# Altium schematic sheet Z7_BANK500_501.SchDoc
size A3
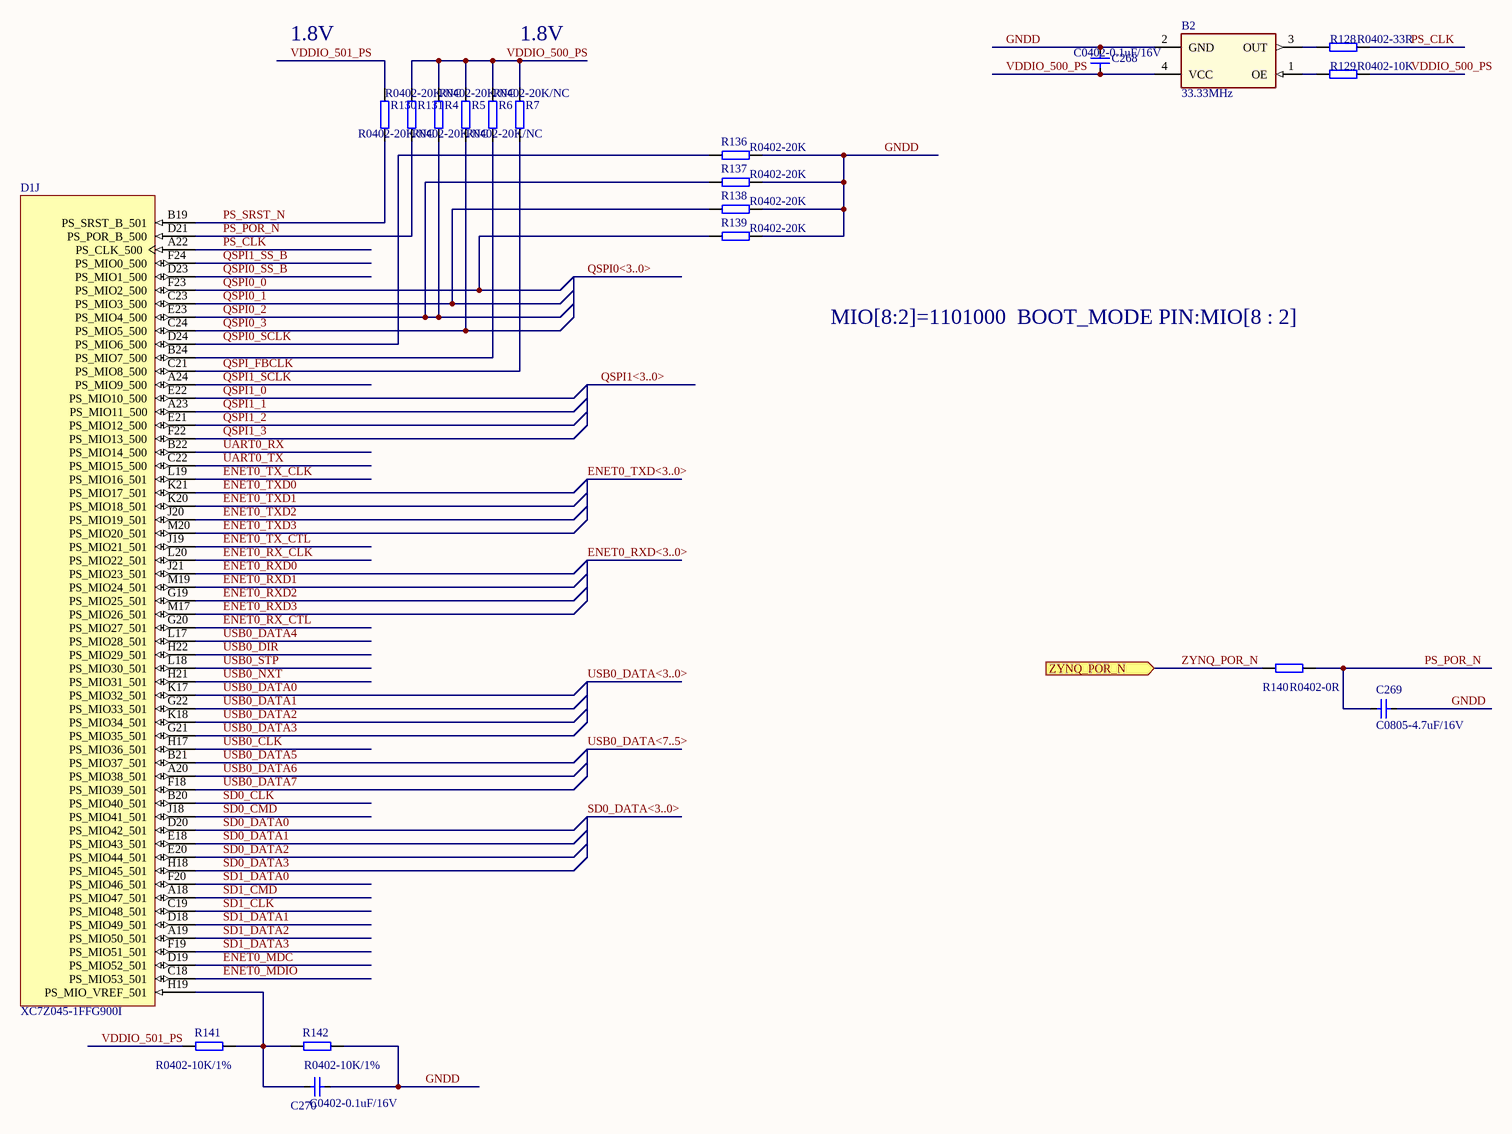
[diagram p0: Z7_BANK500_501.SchDoc]

## Parts
B2  33.33MHz  [OSC3225-4P]
C268  C0402-0.1uF/16V  [C0402]
C269  C0805-4.7uF/16V  [C0805]
C270  C0402-0.1uF/16V  [C0402]
D1  XC7Z045-1FFG900I  [FFG900]  (part J of 16)
R4  R0402-20K/NC  [R0402]
R5  R0402-20K/NC  [R0402]
R6  R0402-20K/NC  [R0402]
R7  R0402-20K/NC  [R0402]
R128  R0402-33R  [R0402]
R129  R0402-10K  [R0402]
R130  R0402-20K/NC  [R0402]
R131  R0402-20K/NC  [R0402]
R136  R0402-20K  [R0402]
R137  R0402-20K  [R0402]
R138  R0402-20K  [R0402]
R139  R0402-20K  [R0402]
R140  R0402-0R  [R0402]
R141  R0402-10K/1%  [R0402]
R142  R0402-10K/1%  [R0402]

## Ports
ZYNQ_POR_N (in)

## Nets
ENET0_MDC: D1.D19(PS_MIO52_501)
ENET0_MDIO: D1.C18(PS_MIO53_501)
ENET0_RX_CLK: D1.L20(PS_MIO22_501)
ENET0_RX_CTL: D1.G20(PS_MIO27_501)
ENET0_RXD0: D1.J21(PS_MIO23_501)
ENET0_RXD1: D1.M19(PS_MIO24_501)
ENET0_RXD2: D1.G19(PS_MIO25_501)
ENET0_RXD3: D1.M17(PS_MIO26_501)
ENET0_TX_CLK: D1.L19(PS_MIO16_501)
ENET0_TX_CTL: D1.J19(PS_MIO21_501)
ENET0_TXD0: D1.K21(PS_MIO17_501)
ENET0_TXD1: D1.K20(PS_MIO18_501)
ENET0_TXD2: D1.J20(PS_MIO19_501)
ENET0_TXD3: D1.M20(PS_MIO20_501)
GNDD: B2.2(GND) C268.2 C269.2 C270.2 R136.1 R137.1 R138.1 R139.1 R142.1
PS_CLK: D1.A22(PS_CLK_500) R128.2
PS_POR_N: C269.1 D1.D21(PS_POR_B_500) R131.1 R140.2
PS_SRST_N: D1.B19(PS_SRST_B_501) R130.1
QSPI0_0: D1.F23(PS_MIO2_500) R139.2
QSPI0_1: D1.C23(PS_MIO3_500) R138.2
QSPI0_2: D1.E23(PS_MIO4_500) R4.1 R137.2
QSPI0_3: D1.C24(PS_MIO5_500) R5.1
QSPI0_SCLK: D1.D24(PS_MIO6_500) R136.2
QSPI0_SS_B: D1.D23(PS_MIO1_500)
QSPI1_0: D1.E22(PS_MIO10_500)
QSPI1_1: D1.A23(PS_MIO11_500)
QSPI1_2: D1.E21(PS_MIO12_500)
QSPI1_3: D1.F22(PS_MIO13_500)
QSPI1_SCLK: D1.A24(PS_MIO9_500)
QSPI1_SS_B: D1.F24(PS_MIO0_500)
QSPI_FBCLK: D1.C21(PS_MIO8_500) R7.1
SD0_CLK: D1.B20(PS_MIO40_501)
SD0_CMD: D1.J18(PS_MIO41_501)
SD0_DATA0: D1.D20(PS_MIO42_501)
SD0_DATA1: D1.E18(PS_MIO43_501)
SD0_DATA2: D1.E20(PS_MIO44_501)
SD0_DATA3: D1.H18(PS_MIO45_501)
SD1_CLK: D1.C19(PS_MIO48_501)
SD1_CMD: D1.A18(PS_MIO47_501)
SD1_DATA0: D1.F20(PS_MIO46_501)
SD1_DATA1: D1.D18(PS_MIO49_501)
SD1_DATA2: D1.A19(PS_MIO50_501)
SD1_DATA3: D1.F19(PS_MIO51_501)
UART0_RX: D1.B22(PS_MIO14_500)
UART0_TX: D1.C22(PS_MIO15_500)
USB0_CLK: D1.H17(PS_MIO36_501)
USB0_DATA0: D1.K17(PS_MIO32_501)
USB0_DATA1: D1.G22(PS_MIO33_501)
USB0_DATA2: D1.K18(PS_MIO34_501)
USB0_DATA3: D1.G21(PS_MIO35_501)
USB0_DATA4: D1.L17(PS_MIO28_501)
USB0_DATA5: D1.B21(PS_MIO37_501)
USB0_DATA6: D1.A20(PS_MIO38_501)
USB0_DATA7: D1.F18(PS_MIO39_501)
USB0_DIR: D1.H22(PS_MIO29_501)
USB0_NXT: D1.H21(PS_MIO31_501)
USB0_STP: D1.L18(PS_MIO30_501)
VDDIO_500_PS: B2.4(VCC) C268.1 R4.2 R5.2 R6.2 R7.2 R129.2 R131.2
VDDIO_501_PS: R130.2 R141.2
ZYNQ_POR_N: R140.1 ; port ZYNQ_POR_N
NetB2_1: B2.1(OE) R129.1
NetB2_3: B2.3(OUT) R128.1
NetC270_1: C270.1 D1.H19(PS_MIO_VREF_501) R141.1 R142.2
NetD1_B24: D1.B24(PS_MIO7_500) R6.1

## Buses and harness runs
bus ENET0_RXD<3..0>
bus ENET0_TXD<3..0>
bus QSPI0<3..0>
bus QSPI1<3..0>
bus SD0_DATA<3..0>
bus USB0_DATA<3..0>
bus USB0_DATA<7..5>

## Notes on the sheet
- 1.8V
- MIO[8:2]=1101000  BOOT_MODE PIN:MIO[8 : 2]

## Library data of the parts
B2 = XTAL-50MHz-3.3V: 有源晶振, 33.33MHz, 1.8V电压
C268 C270 = C0402-0.1uF/16V: X7R; Manufacturer: SAMSUNG; Manufacturer_p/n: CL05X7R104KO5NNN; Part_number: C0402-0.1uF/16V; Part_type: CAP; Value: C0402-0.1uF/16V; temperature: -55℃\+125℃; Schematic_Part: CAP; PCB_Footprint: C0402; datasheet: #DataSheet\C_Samsung_General Capacitors.pdf#
C269 = C0805-4.7uF/50V: X7R; Manufacturer: SAMSUNG; Part_number: C0805-4.7uF/16V; Part_type: CAP; Value: C0805-4.7uF/16V; Schematic_Part: CAP; PCB_Footprint: C0805; datasheet: #DataSheet\C_Samsung_General Capacitors.pdf#
D1 = XC7Z045-1FFG900I: 667 MHz Zynq?7000 AP SoC, 130 PS I/O, 378 FPGA I/O, 900-Ball BGA, Speed Grade 1, Industrial Grade, Pb-Free; Manufacturer: Xilinx; Extensible Block RAM (# 36Kb Blocks): 2180 KB (545); Flip Flops: 437200; LUTs: 218600; Speed Grade: -1; DatasheetVersion: v1.2; PackageVersion: Rev 1.1; PackageReference: FFG900; PackageDescription: Flip-Chip BGA, Body 31 x 31 mm, 1.0 mm Pitch; Generic Part Number: XC7Z045; RoHS: Pb-Free; Mounting Technology: Surface Mount; Code_JEDEC: MS-034-AAN-1; PartNumber: XC7Z045-1FFG900I; ComponentLink1Description: Datasheet; ComponentLink1URL: http://www.xilinx.com/support/documentation/data_sheets/ds190-Zynq-7000-Overview.pdf; ComponentLink2Description: Package Specification; ComponentLink2URL: http://www.xilinx.com/support/documentation/user_guides/ug865-Zynq-7000-Pkg-Pinout.pdf; ComponentLink3Description: DC and AC Switching Characteristics; ComponentLink3URL: http://www.xilinx.com/support/documentation/data_sheets/ds191-XC7Z030-XC7Z045-data-sheet.pdf; ComponentLink4Description: Package File; ComponentLink4URL: http://www.xilinx.com/support/packagefiles/z7packages/xc7z045ffg900pkg.txt; ComponentLink5Description: Packaging and Pinout; ComponentLink5URL: http://www.xilinx.com/support/documentation/user_guides/ug865-Zynq-7000-Pkg-Pinout.pdf; ComponentLink6Description: PCB and Layout Guide; ComponentLink6URL: http://www.xilinx.com/support/documentation/user_guides/ug483_7Series_PCB.pdf
R4-R7 R128-R131 R136-R142 = R0402-10K: Manufacturer: SAMSUNG; Part_type: RES; Schematic_Part: RES; PCB_Footprint: R0402
  R4-R7 R130 R131: Part_number: R0402-20K/NC; Value: R0402-20K/NC
  R128: Part_number: R0402-33R; Value: R0402-33R
  R129: Part_number: R0402-10K; Value: R0402-10K
  R136-R139: Part_number: R0402-20K; Value: R0402-20K
  R140: Part_number: R0402-0R; Value: R0402-0R
  R141 R142: Part_number: R0402-10K/1%; Value: R0402-10K/1%